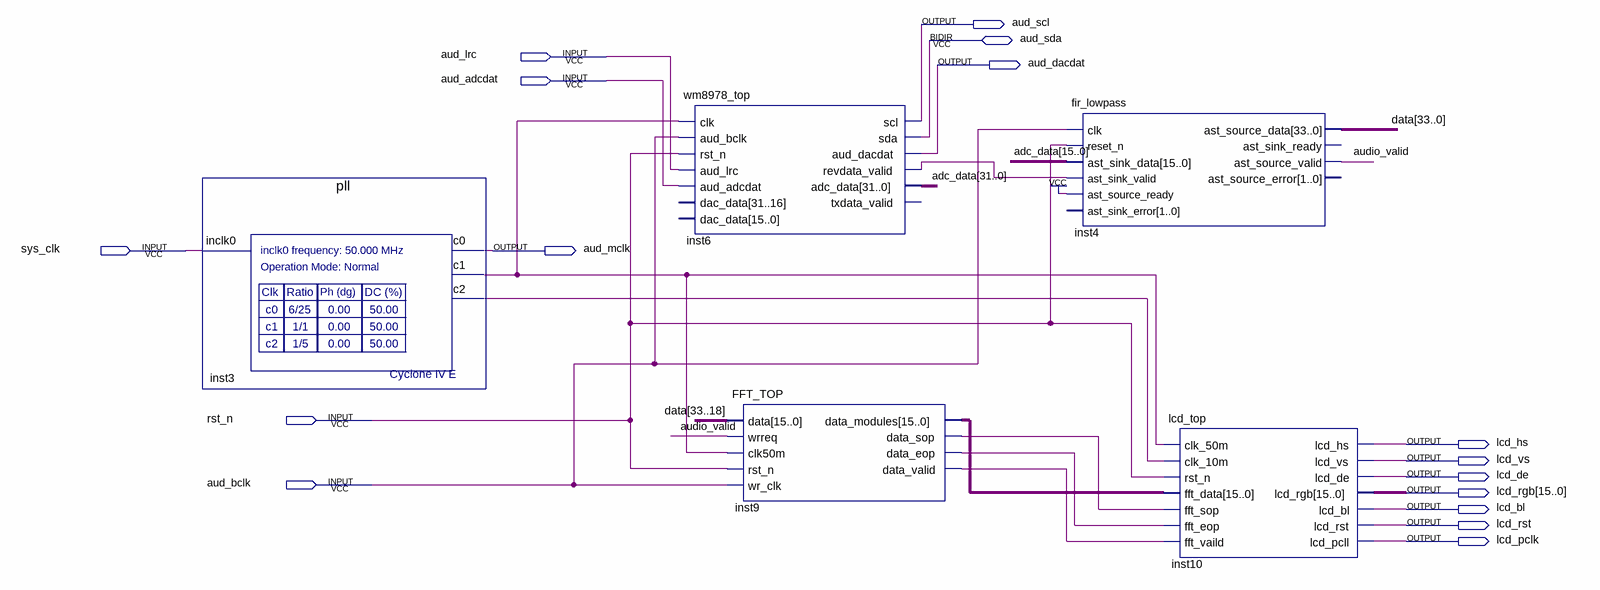
[diagram p0: schematic sheet]
// Quartus schematic FIR_audio_lcd_top.bdf as structural Verilog: 5 symbols, 16 pins
module FIR_audio_lcd_top (
  input  aud_lrc,
  input  aud_adcdat,
  input  sys_clk,
  input  rst_n,
  input  aud_bclk,
  inout  aud_sda,
  output aud_scl,
  output aud_dacdat,
  output aud_mclk,
  output lcd_hs,
  output lcd_vs,
  output lcd_de,
  output [15:0] lcd_rgb,
  output lcd_bl,
  output lcd_rst,
  output lcd_pclk
);

  wire audio_valid, inst3_c1, inst3_c2, inst6_revdata_valid, inst9_data_eop, inst9_data_sop, inst9_data_valid;
  wire [15:0] inst9_data_modules;
  wire [31:0] adc_data;
  wire [33:0] data;

  pll inst3 (.inclk0(sys_clk), .c0(aud_mclk), .c1(inst3_c1), .c2(inst3_c2));
  wm8978_top inst6 (
    .clk(inst3_c1), .aud_bclk(aud_bclk), .rst_n(rst_n), .aud_lrc(aud_lrc), .aud_adcdat(aud_adcdat),
    .scl(aud_scl), .aud_dacdat(aud_dacdat), .revdata_valid(inst6_revdata_valid), .adc_data(adc_data),
    .sda(aud_sda));  // open: dac_data, txdata_valid
  FFT_TOP inst9 (
    .data(data[33:18]), .wrreq(audio_valid), .clk50m(inst3_c1), .rst_n(rst_n), .wr_clk(aud_bclk),
    .data_modules(inst9_data_modules), .data_sop(inst9_data_sop), .data_eop(inst9_data_eop),
    .data_valid(inst9_data_valid));
  fir_lowpass inst4 (
    .clk(aud_bclk), .reset_n(rst_n), .ast_sink_data(adc_data[15:0]), .ast_sink_valid(inst6_revdata_valid),
    .ast_source_ready(1'b1), .ast_source_data(data), .ast_source_valid(audio_valid));  // open: ast_sink_error, ast_sink_ready, ast_source_error
  lcd_top inst10 (
    .clk_50m(inst3_c1), .clk_10m(inst3_c2), .rst_n(rst_n), .fft_data(inst9_data_modules),
    .fft_sop(inst9_data_sop), .fft_eop(inst9_data_eop), .fft_vaild(inst9_data_valid), .lcd_hs(lcd_hs),
    .lcd_vs(lcd_vs), .lcd_de(lcd_de), .lcd_rgb(lcd_rgb), .lcd_bl(lcd_bl), .lcd_rst(lcd_rst),
    .lcd_pcll(lcd_pclk));
endmodule
